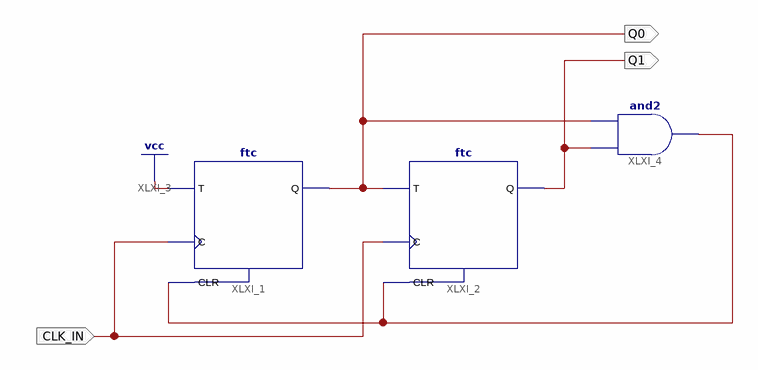
[diagram p0: schematic sheet 1]
// Xilinx ISE schematic counter0_2.sch (spartan6) as structural Verilog: 3 symbols, 3 ports
module counter0_2 (
  input  CLK_IN,
  output Q0,
  output Q1
);

  wire XLXN_8;

  ftc XLXI_1 (.C(CLK_IN), .CLR(XLXN_8), .T(1'b1), .Q(Q0));
  ftc XLXI_2 (.C(CLK_IN), .CLR(XLXN_8), .T(Q0), .Q(Q1));
  and XLXI_4 (XLXN_8, Q1, Q0);
endmodule
